# EAGLE design Light SOT32 (EAGLE 9.2.2)
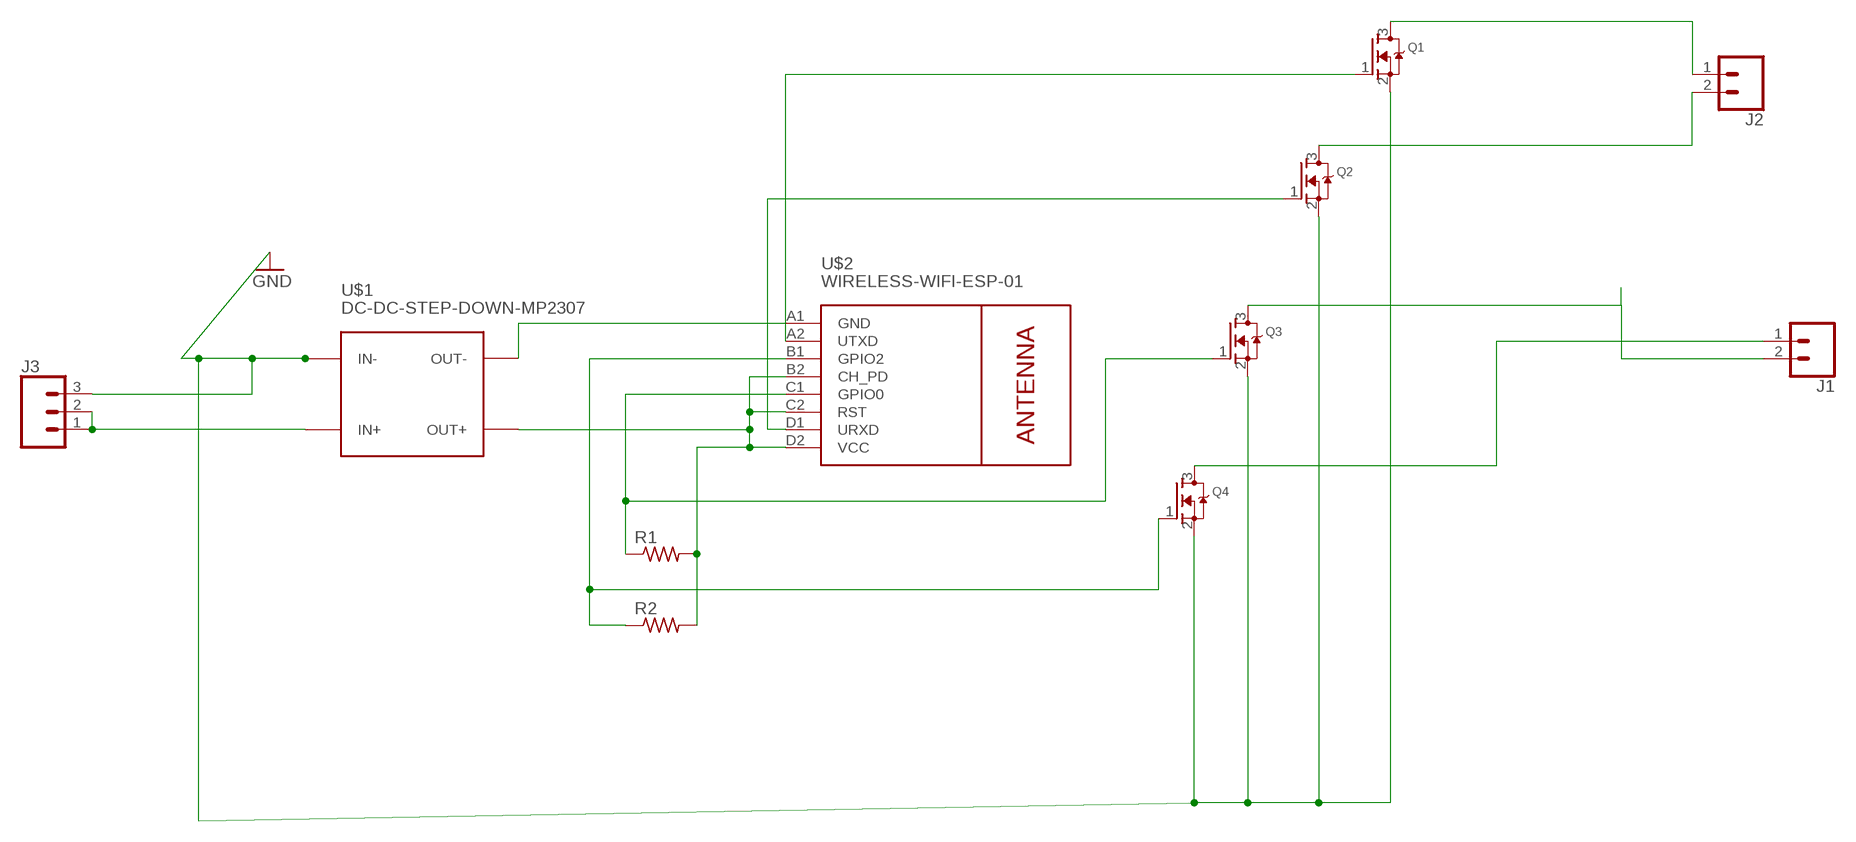
[diagram p0: schematic, sheet 1]

## Parts
J1  CONN_023.5MM  [SCREWTERMINAL-3.5MM-2]
J2  CONN_023.5MM  [SCREWTERMINAL-3.5MM-2]
J3  CONN_03SCREW  [SCREWTERMINAL-3.5MM-3]
Q1  MOSFET-NREFLOW  [SOT23]
Q2  MOSFET-NREFLOW  [SOT23]
Q3  MOSFET-NREFLOW  [SOT23]
Q4  MOSFET-NREFLOW  [SOT23]
R1  R-US_R0805  [R0805]
R2  R-US_R0805  [R0805]
U$1  DC-DC-STEP-DOWN-MP2307  [DC-DC-STEP-DOWN-MP2307]
U$2  WIRELESS-WIFI-ESP-01  [WIRELESS-WIFI-ESP-01]

## Nets
GND: J3.3 Q1.2(S) Q2.2(S) Q3.2(S) Q4.2(S) U$1.IN-
N$1: R1.2 R2.2 U$1.OUT+ U$2.B2(CH_PD) U$2.C2(RST) U$2.D2(VCC)
N$2: Q2.1(G) U$2.D1(URXD)
N$3: U$1.OUT- U$2.A1(GND)
N$4: Q3.1(G) R1.1 U$2.C1(GPIO0)
N$5: Q4.1(G) R2.1 U$2.B1(GPIO2)
N$6: Q1.1(G) U$2.A2(UTXD)
N$7: J3.1 J3.2 U$1.IN+
N$8: J2.2 Q2.3(D)
N$9: J2.1 Q1.3(D)
N$10: J1.1 Q4.3(D)
N$11: J1.2 Q3.3(D)

## Library data of the parts
J1 J2 = custom:CONN_02: Multi connection point. Often used as Generic Header-pin footprint for 0.1 inch spaced/style header connections On any of the 0.1 inch spaced packages, you can populate with these: Break Away Headers - Straight <https://www.sparkfun.com/products/116> (PRT-00116) Break Away Male Headers - Right Angle <https://www.sparkfun.com/products/553> (PRT-00553) Female Headers <https://www.sparkfun.com/products/115> (PRT-00115) Break Away Headers - Machine Pin <https://www.sparkfun.com/products/117> (PRT-00117) Break Away Female Headers - Swiss Machine Pin <https://www.sparkfun.com/products/743> (PRT-00743) For SCREWTERMINALS and SPRING TERMINALS visit here: Screw Terimnals on SparkFun.com <https://www.sparkfun.com/search/results?term=Screw+Terminals> (5mm/3.5mm/2.54mm spacing) This device is also useful as a general connection point to wire up your design to another part of your project. Our various solder wires solder well into these plated through hole pads. Hook-Up Wire - Assortment (Stranded, 22 AWG) <https://www.sparkfun.com/products/11375> (PRT-11375) Hook-Up Wire - Assortment (Solid Core, 22 AWG) <https://www.sparkfun.com/products/11367> (PRT-11367) View the entire wire category on our website here <https://www.sparkfun.com/categories/141> Special notes: Molex polarized connector foot print use with: PRT-08233 with associated crimp pins and housings. 2.54_SCREWTERM for use with PRT-10571. 3.5mm Screw Terminal footprints for PRT-08084 5mm Screw Terminal footprints for use with PRT-08432; PROD_ID: CONN-08399
J3 = custom:CONN_03: Multi connection point. Often used as Generic Header-pin footprint for 0.1 inch spaced/style header connections On any of the 0.1 inch spaced packages, you can populate with these: Break Away Headers - Straight <https://www.sparkfun.com/products/116> (PRT-00116) Break Away Male Headers - Right Angle <https://www.sparkfun.com/products/553> (PRT-00553) Female Headers <https://www.sparkfun.com/products/115> (PRT-00115) Break Away Headers - Machine Pin <https://www.sparkfun.com/products/117> (PRT-00117) Break Away Female Headers - Swiss Machine Pin <https://www.sparkfun.com/products/743> (PRT-00743) Stackable Header - 3 Pin (Female, 0.1") <https://www.sparkfun.com/products/13875> (PRT-13875) For SCREWTERMINALS and SPRING TERMINALS visit here: Screw Terimnals on SparkFun.com <https://www.sparkfun.com/search/results?term=Screw+Terminals> (5mm/3.5mm/2.54mm spacing) This device is also useful as a general connection point to wire up your design to another part of your project. Our various solder wires solder well into these plated through hole pads. Hook-Up Wire - Assortment (Stranded, 22 AWG) <https://www.sparkfun.com/products/11375> (PRT-11375) Hook-Up Wire - Assortment (Solid Core, 22 AWG) <https://www.sparkfun.com/products/11367> (PRT-11367) View the entire wire category on our website here <https://www.sparkfun.com/categories/141> Special notes: Molex polarized connector foot print use with SKU : PRT-08232 with associated crimp pins and housings.; PROD_ID: CONN-08288; SF_ID: PRT-08235
Q1-Q4 = adafruit:MOSFET-N: N-Channel Mosfet 2N7002E - 60V 260mA SOT23 [Digikey: 2N7002ET1GOSTR-ND] - REEL BSH103 - 30V 850mA SOT23 [Digikey: 568-5013-1-ND]
R1 R2 = adafruit:R-US_: RESISTOR, American symbol
U$1 = custom:DC-DC-STEP-DOWN-MP2307: DC/DC Step-Down Regulator based on MP2307DN chip MP2307 datasheet available here: https://cdn-shop.adafruit.com/datasheets/MP2307_r1.9.pdf Click here to find device on ebay.com <http://www.ebay.com/sch/dc+dc+3a+mini+converter>; OC_FARNELL: unknown
U$2 = custom:WIRELESS-WIFI-ESP-01: Wireless Wi-Fi ESP-01 Module based on ESP8266 chip Click here to find device on ebay.com <http://www.ebay.com/sch/esp8266+esp+01+transceiver>; OC_FARNELL: unknown; SPICEPREFIX: X

## Board
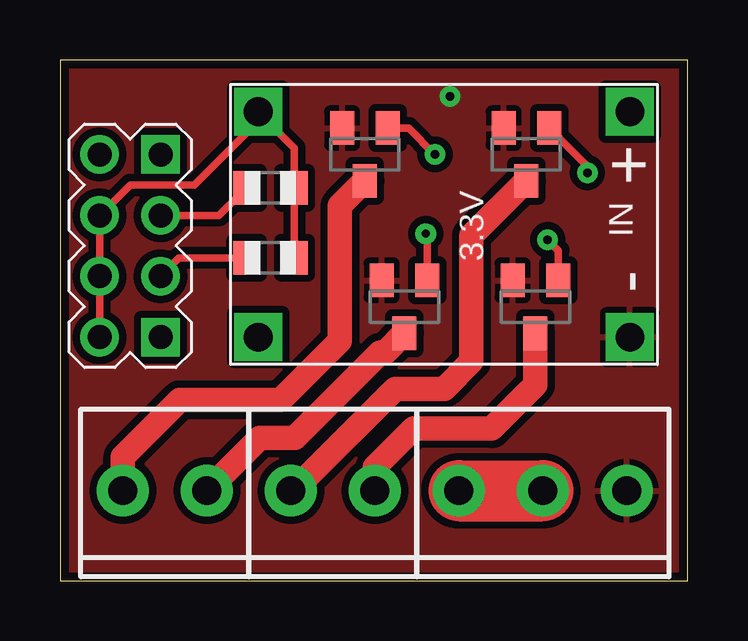
[diagram p1: board, top side]
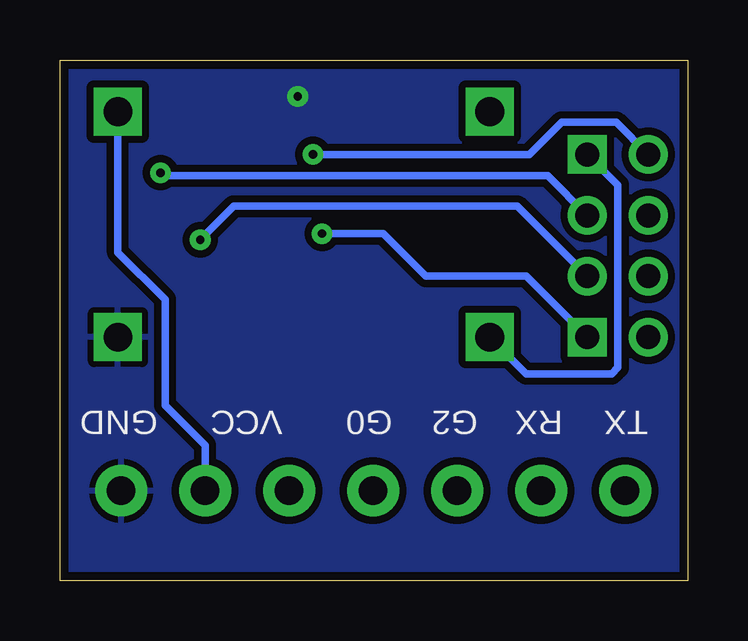
[diagram p2: board, bottom side, seen from below]

Size 26.16 x 21.72 mm. Coordinates in mm from the lower left corner, seen from the top.
Outline: 0,0 26.16,0.01 26.16,21.72 0,21.71 0,0
Copper layers (1*16): Top 0.035mm / dielectric 1.5mm / Bottom 0.035mm
Design rules "default *": minimum track width 6mil, minimum drill 0.35mm, track to track 12mil, track to pad 12mil, pad to pad 12mil, via to via 12mil, smd to smd 12mil, copper to edge 14mil, drill to drill 6mil, minimum pad ring 12mil, minimum via ring 10mil, stop-mask expansion 4mil, vias tented up to drill 15mil, thermal gap 10mil

### Footprints (pad centres in the part's own frame; a part is rotated, then mirrored left to right if it is on the bottom)
SCREWTERMINAL-3.5MM-2 = drill 1.2 pad 2.159: 1 0,0; 2 3.5,0
SCREWTERMINAL-3.5MM-3 = drill 1.2 pad 2.159: 1 0,0; 2 3.5,0; 3 7,0
SOT23 = smd 1 x 1.4: 1 -0.95,-1.1; 2 0.95,-1.1; 3 0,1.1
R0805 = smd 1.1 x 1.4: 1 -1,0; 2 1,0
DC-DC-STEP-DOWN-MP2307 = drill 1.2 pad 2 square: IN+ -7.747,-4.699; IN- -7.747,4.699; OUT+ 7.747,-4.699; OUT- 7.747,4.699
WIRELESS-WIFI-ESP-01 = drill 1 square: A1 -8.89,3.81; D1 -8.89,-3.81 | drill 1: A2 -11.43,3.81; B1 -8.89,1.27; B2 -11.43,1.27; C1 -8.89,-1.27; C2 -11.43,-1.27; D2 -11.43,-3.81

### Placement (x,y rotation side)
J1  9.62,3.76 0 top
J2  2.62,3.76 0 top
J3  16.62,3.76 0 top
Q1  12.7,17.78 180 top
Q2  14.35,11.43 180 top
Q3  19.81,11.43 180 top
Q4  19.43,17.78 180 top
R1  8.76,13.46 0 top
R2  8.76,16.38 0 top
U$1  16,14.86 180 top
U$2  13.08,13.97 0 top

### Tracks (layer width: path | path; a pad name or v marks a point on that pad's centre or on a via)
GND  (via drill 0.35)
  other vias: 16.26,20.19
  pour Top: 0,21.72 0,0 26.16,0 26.16,21.72
  pour Bottom: 0,21.72 0,0 26.16,0 26.16,21.59 26.16,21.72
N$1
  Top 0.305: U$2.D2 U$2.C2 U$2.B2 2.92,16.51 5.59,16.51 8.25,19.18 U$1.OUT+ 9.76,18.05 R2.2 R1.2
N$2  (via drill 0.35)
  Top 0.305: Q2.1 15.3,14.42 v15.24,14.48
  Bottom 0.305: U$2.D1 6.73,12.7 10.92,12.7 12.7,14.48 v15.24,14.48
N$3
  Bottom 0.305: U$2.A1 2.92,16.51 2.92,8.89 3.18,8.64 6.73,8.64 U$1.OUT-
N$4  (via drill 0.35)
  Top 0.305: R1.1 4.95,13.46 U$2.C1 | Q3.1 20.76,13.78 v20.32,14.22
  Bottom 0.305: v20.32,14.22 18.92,15.62 7.11,15.62 U$2.C1
N$5  (via drill 0.35)
  Top 0.305: R2.1 6.62,15.24 U$2.B1 | Q4.1 21.97,17.29 v21.97,17.02
  Bottom 0.305: U$2.B1 5.84,16.89 21.84,16.89 v21.97,17.02
N$6  (via drill 0.35)
  Top 0.305: v15.62,17.78 14.52,18.88 Q1.1
  Bottom 0.305: v15.62,17.78 6.6,17.78 5.26,19.12 2.99,19.12 U$2.A2
N$7
  Top 2.54: J3.1 J3.2
  Bottom 0.305: J3.2 20.12,5.65 21.78,7.32 21.78,11.73 23.75,13.7 U$1.IN+
N$8
  Top 1.016: Q2.3 13.55,9.52 13.33,9.52 9.78,5.97 8.33,5.97 J2.2
N$9
  Top 1.016: Q1.3 11.66,15.64 11.66,9.99 9.21,7.54 4.99,7.54 2.62,5.17 J2.1
N$10
  Top 0.61: J1.1 9.72,3.76
  Top 1.016: Q4.3 17.14,14.39 17.14,9.14 16,8 13.96,8 9.72,3.76
N$11
  Top 1.016: Q3.3 19.81,8.17 17.99,6.35 14.73,6.35 13.12,4.73 J1.2

### Text on the board
tPlace: + | IN | 3.3V | -
bPlace: TX | RX | G2 | G0 | VCC | GND